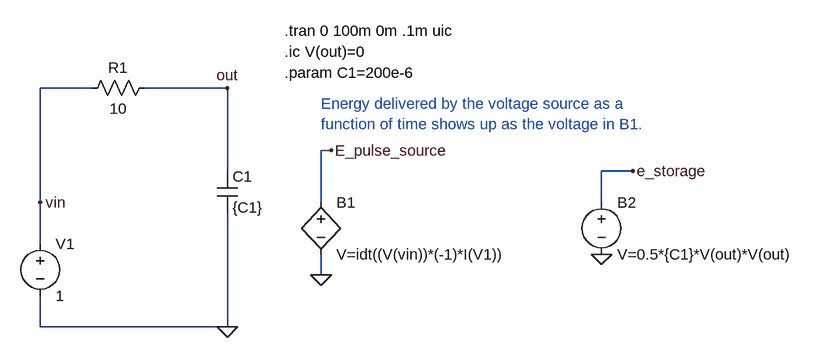
[diagram p0: schematic integrate_power_for_energy.asc]
integrate_power_for_energy.asc, the LTspice schematic file:
Version 4
SHEET 1 5584 680
WIRE -1152 -624 -1232 -624
WIRE -944 -624 -1072 -624
WIRE -784 -528 -800 -528
WIRE -944 -496 -944 -624
WIRE -320 -496 -368 -496
WIRE -1232 -448 -1232 -624
WIRE -800 -448 -800 -528
WIRE -368 -448 -368 -496
WIRE -1232 -384 -1232 -448
WIRE -800 -336 -800 -368
WIRE -1232 -256 -1232 -304
WIRE -944 -256 -944 -432
WIRE -944 -256 -1232 -256
FLAG -368 -368 0
FLAG -320 -496 e_storage
FLAG -800 -336 0
FLAG -784 -528 E_pulse_source
FLAG -944 -624 out
FLAG -944 -256 0
FLAG -1232 -448 vin
SYMBOL voltage -368 -464 R0
SYMATTR InstName B2
SYMATTR Value V=0.5*{C1}*V(out)*V(out)
SYMATTR Prefix B
SYMBOL bv -800 -464 R0
SYMATTR InstName B1
SYMATTR Value V=idt((V(vin))*(-1)*I(V1))
SYMBOL res -1056 -640 R90
WINDOW 0 0 56 VBottom 0
WINDOW 3 32 56 VTop 0
SYMATTR InstName R1
SYMATTR Value 10
SYMBOL cap -960 -496 R0
SYMATTR InstName C1
SYMATTR Value {C1}
SYMBOL voltage -1232 -400 R0
SYMATTR InstName V1
SYMATTR Value 1
TEXT -856 -712 Left 0 !.tran 0 100m 0m .1m uic
TEXT -856 -680 Left 0 !.ic V(out)=0
TEXT -856 -648 Left 0 !.param C1=200e-6
TEXT -800 -600 Left 0 ;Energy delivered by the voltage source as a\nfunction of time shows up as the voltage in B1.

The netlist it stands for:
* integrate_power_for_energy.asc
B2 e_storage 0 V=0.5*{C1}*V(out)*V(out)
B1 E_pulse_source 0 V=idt((V(vin))*(-1)*I(V1))
R1 out vin 10
C1 out 0 {C1}
V1 vin 0 1
.tran 0 100m 0m .1m uic
.ic V(out)=0
.param C1=200e-6
* Energy delivered by the voltage source as a
* function of time shows up as the voltage in B1.
.backanno
.end